# EAGLE schematic teensy_speeduino_5.1 (EAGLE 9.5.0)
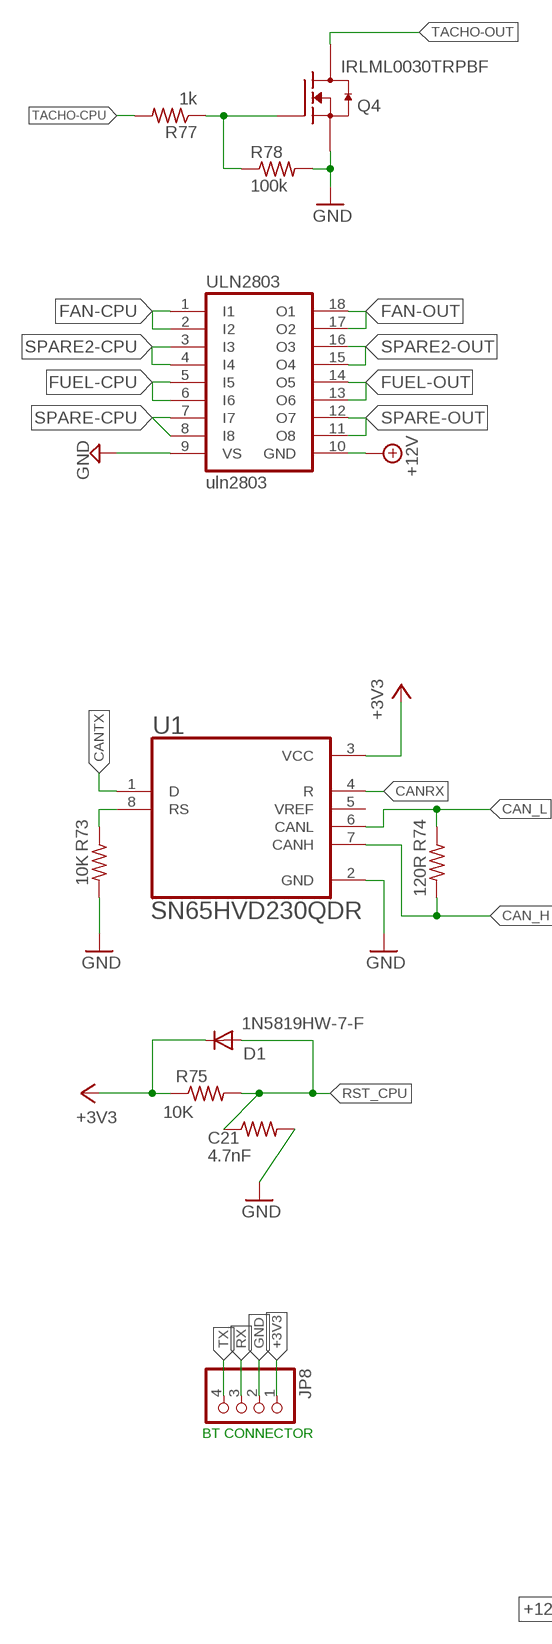
[diagram p0: schematic, sheet 1, part 1 of 2]
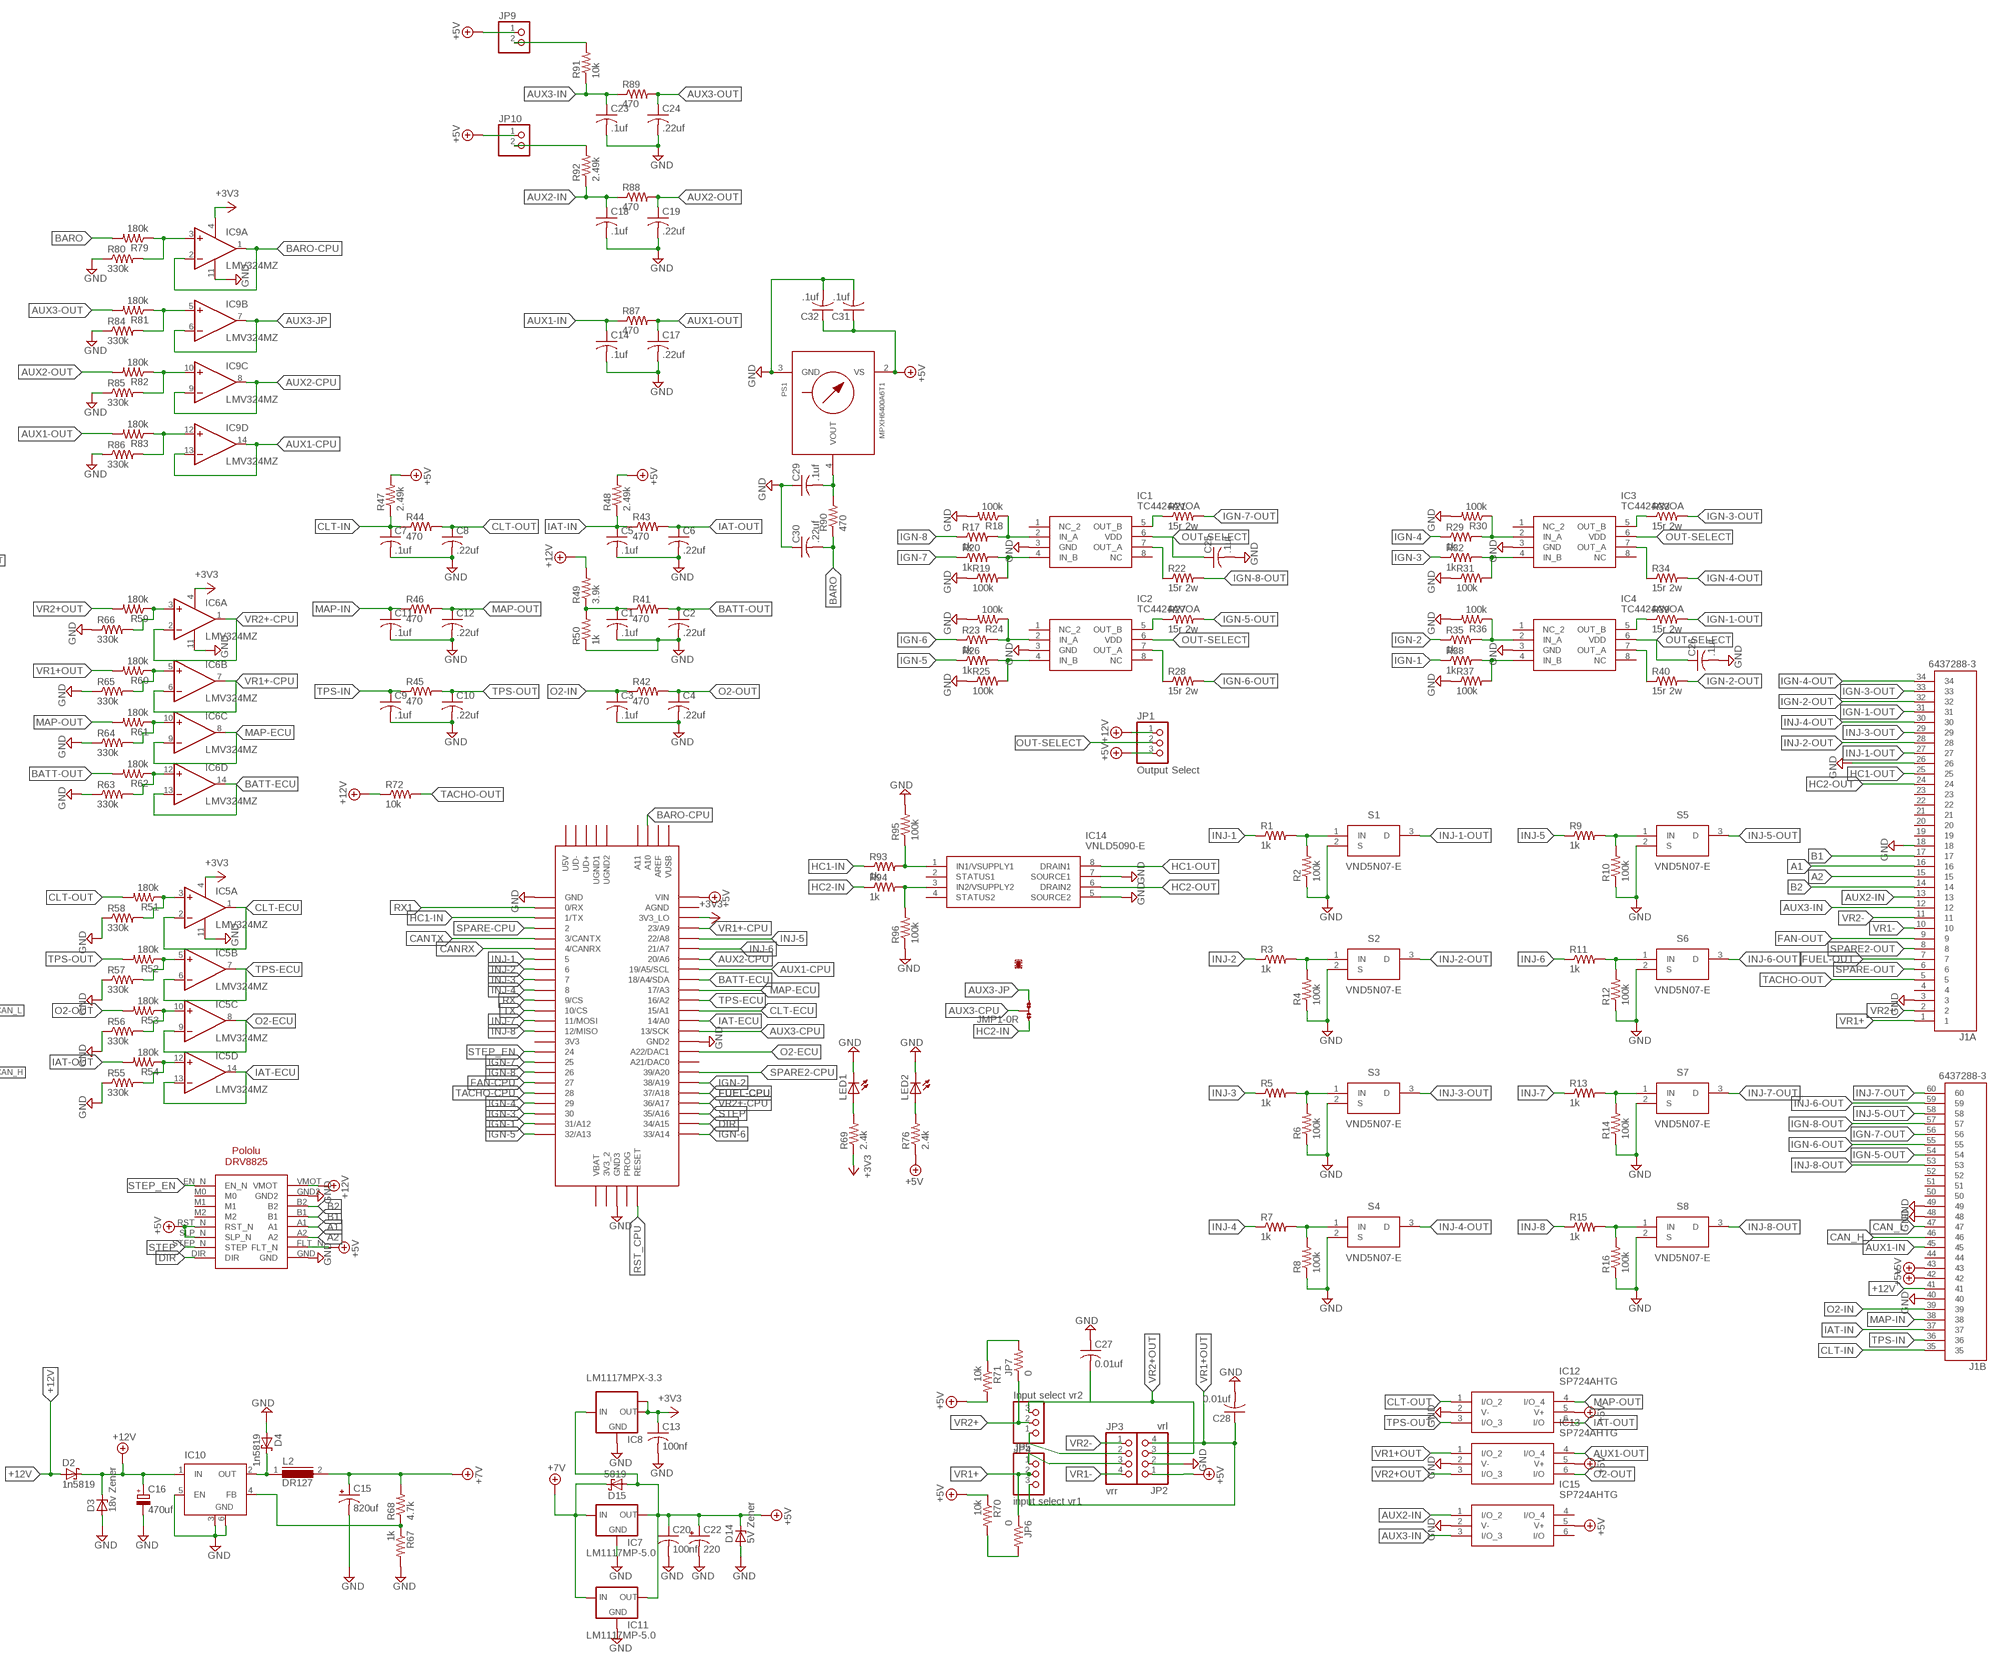
[diagram p1: schematic, sheet 1, part 2 of 2]

## Parts
C1  .1uf  C-USC1206  [C1206]
C2  .22uf  C-USC1206  [C1206]
C3  .1uf  C-USC1206  [C1206]
C4  .22uf  C-USC1206  [C1206]
C5  .1uf  C-USC1206  [C1206]
C6  .22uf  C-USC1206  [C1206]
C7  .1uf  C-USC1206  [C1206]
C8  .22uf  C-USC1206  [C1206]
C9  .1uf  C-USC1206  [C1206]
C10  .22uf  C-USC1206  [C1206]
C11  .1uf  C-USC1206  [C1206]
C12  .22uf  C-USC1206  [C1206]
C13  100nf  C-USC1206  [C1206]
C14  .1uf  C-USC0805  [C0805]
C15  820uf  CPOL-US153CLV-0810  [153CLV-0810]
C16  470uf  CPOL-EU153CLV-0810  [153CLV-0810]
C17  .22uf  C-USC0805  [C0805]
C18  .1uf  C-USC0805  [C0805]
C19  .22uf  C-USC0805  [C0805]
C20  100nf  C-USC1206  [C1206]
C21  4.7nF  R-US_R1206  [R1206]
C22  220  CPOL-US153CLV-0605  [153CLV-0605]
C23  .1uf  C-USC0805  [C0805]
C24  .22uf  C-USC0805  [C0805]
C25  .1uf  C-USC0805  [C0805]
C26  .1uf  C-USC0805  [C0805]
C27  0.01uf  C-USC1206  [C1206]
C28  0.01uf  C-USC1206  [C1206]
C29  .1uf  C-USC1206  [C1206]
C30  .22uf  C-USC1206  [C1206]
C31  .1uf  C-USC1206  [C1206]
C32  .1uf  C-USC1206  [C1206]
D1  1N5819HW-7-F  DIODE-SOD123  [SOD123]
D2  1n5819  SCHOTTKY-DIODESMD  [SMB]
D3  18v Zener  ZENER-DIODESMB  [SMB]
D4  1n5819  SCHOTTKY-DIODESMD  [SMB]
D14  5V Zener  ZENER-DIODESMB  [SMB]
D15  5819  SCHOTTKY-DIODESMD  [SMB]
IC1  TC4424AVOA  [SOIC127P600X175-8N]
IC2  TC4424AVOA  [SOIC127P600X175-8N]
IC3  TC4424AVOA  [SOIC127P600X175-8N]
IC4  TC4424AVOA  [SOIC127P600X175-8N]
IC5  LMV324MZ  [TSSOP14]
IC6  LMV324MZ  [TSSOP14]
IC7  LM1117MP-5.0  [SOT223]
IC8  LM1117MPX-3.3  [SOT223]
IC9  LMV324MZ  [TSSOP14]
IC10  LM2596S  [TO263-5]
IC11  LM1117MP-5.0  [SOT223]
IC12  SP724AHTG  [SOT95P280X145-6N]
IC13  SP724AHTG  [SOT95P280X145-6N]
IC14  VNLD5090-E  [SOIC127P600X175-8N]
IC15  SP724AHTG  [SOT95P280X145-6N]
J1  6437288-3  [TE_6437288-3]
JMP1  0R-JUMPA  [A0R-JMP]
JP1  Output Select  PINHD-1X3  [1X03]
JP2  vrl  PINHD-1X4  [1X04]
JP3  vrr  PINHD-1X4  [1X04]
JP4  Input select vr2  PINHD-1X3  [1X03]
JP5  input select vr1  PINHD-1X3  [1X03]
JP6  0  R-US_R0805  [R0805]
JP7  0  R-US_R0805  [R0805]
JP8  PINHD-1X4  [1X04]
JP9  PINHD-1X2  [1X02]
JP10  PINHD-1X2  [1X02]
L2  DR127  [DR127]
LED1  LEDSML1206  [SML1206]
LED2  LEDSML1206  [SML1206]
PS1  MPXH6400A6T1  [1317]
Q4  IRLML0030TRPBF  MOSFET-NCH_SOT-23  [SOT95P280X135-3N]
R1  1k  R-US_R1206  [R1206]
R2  100k  R-US_R1206  [R1206]
R3  1k  R-US_R1206  [R1206]
R4  100k  R-US_R1206  [R1206]
R5  1k  R-US_R1206  [R1206]
R6  100k  R-US_R1206  [R1206]
R7  1k  R-US_R1206  [R1206]
R8  100k  R-US_R1206  [R1206]
R9  1k  R-US_R1206  [R1206]
R10  100k  R-US_R1206  [R1206]
R11  1k  R-US_R1206  [R1206]
R12  100k  R-US_R1206  [R1206]
R13  1k  R-US_R1206  [R1206]
R14  100k  R-US_R1206  [R1206]
R15  1k  R-US_R1206  [R1206]
R16  100k  R-US_R1206  [R1206]
R17  1k  R-US_R1206  [R1206]
R18  100k  R-US_R1206  [R1206]
R19  100k  R-US_R1206  [R1206]
R20  1k  R-US_R1206  [R1206]
R21  15r 2w  R-US_R2512  [R2512]
R22  15r 2w  R-US_R2512  [R2512]
R23  1k  R-US_R1206  [R1206]
R24  100k  R-US_R1206  [R1206]
R25  100k  R-US_R1206  [R1206]
R26  1k  R-US_R1206  [R1206]
R27  15r 2w  R-US_R2512  [R2512]
R28  15r 2w  R-US_R2512  [R2512]
R29  1k  R-US_R1206  [R1206]
R30  100k  R-US_R1206  [R1206]
R31  100k  R-US_R1206  [R1206]
R32  1k  R-US_R1206  [R1206]
R33  15r 2w  R-US_R2512  [R2512]
R34  15r 2w  R-US_R2512  [R2512]
R35  1k  R-US_R1206  [R1206]
R36  100k  R-US_R1206  [R1206]
R37  100k  R-US_R1206  [R1206]
R38  1k  R-US_R1206  [R1206]
R39  15r 2w  R-US_R2512  [R2512]
R40  15r 2w  R-US_R2512  [R2512]
R41  470  R-US_R1206  [R1206]
R42  470  R-US_R1206  [R1206]
R43  470  R-US_R1206  [R1206]
R44  470  R-US_R1206  [R1206]
R45  470  R-US_R1206  [R1206]
R46  470  R-US_R1206  [R1206]
R47  2.49k  R-US_R1206  [R1206]
R48  2.49k  R-US_R1206  [R1206]
R49  3.9k  R-US_R1206  [R1206]
R50  1k  R-US_R1206  [R1206]
R51  180k  R-US_R1206  [R1206]
R52  180k  R-US_R1206  [R1206]
R53  180k  R-US_R1206  [R1206]
R54  180k  R-US_R1206  [R1206]
R55  330k  R-US_R1206  [R1206]
R56  330k  R-US_R1206  [R1206]
R57  330k  R-US_R1206  [R1206]
R58  330k  R-US_R1206  [R1206]
R59  180k  R-US_R1206  [R1206]
R60  180k  R-US_R1206  [R1206]
R61  180k  R-US_R1206  [R1206]
R62  180k  R-US_R1206  [R1206]
R63  330k  R-US_R1206  [R1206]
R64  330k  R-US_R1206  [R1206]
R65  330k  R-US_R1206  [R1206]
R66  330k  R-US_R1206  [R1206]
R67  1k  R-US_R1206  [R1206]
R68  4.7k  R-US_R1206  [R1206]
R69  2.4k  R-US_R1206  [R1206]
R70  10k  R-US_R1206  [R1206]
R71  10k  R-US_R1206  [R1206]
R72  10k  R-US_R1206  [R1206]
R73  10K  R-US_R1206  [R1206]
R74  120R  R-US_R1206  [R1206]
R75  10K  R-US_R1206  [R1206]
R76  2.4k  R-US_R1206  [R1206]
R77  1k  R-US_R1206  [R1206]
R78  100k  R-US_R1206  [R1206]
R79  180k  R-US_R0805  [R0805]
R80  330k  R-US_R0805  [R0805]
R81  180k  R-US_R0805  [R0805]
R82  180k  R-US_R0805  [R0805]
R83  180k  R-US_R0805  [R0805]
R84  330k  R-US_R0805  [R0805]
R85  330k  R-US_R0805  [R0805]
R86  330k  R-US_R0805  [R0805]
R87  470  R-US_R0805  [R0805]
R88  470  R-US_R0805  [R0805]
R89  470  R-US_R0805  [R0805]
R90  470  R-US_R1206  [R1206]
R91  10k  R-US_R1206  [R1206]
R92  2.49k  R-US_R1206  [R1206]
R93  1k  R-US_R1206  [R1206]
R94  1k  R-US_R1206  [R1206]
R95  100k  R-US_R1206  [R1206]
R96  100k  R-US_R1206  [R1206]
S1  VND5N07-E  [TO-252-(DPAK)_1]
S2  VND5N07-E  [TO-252-(DPAK)_1]
S3  VND5N07-E  [TO-252-(DPAK)_1]
S4  VND5N07-E  [TO-252-(DPAK)_1]
S5  VND5N07-E  [TO-252-(DPAK)_1]
S6  VND5N07-E  [TO-252-(DPAK)_1]
S7  VND5N07-E  [TO-252-(DPAK)_1]
S8  VND5N07-E  [TO-252-(DPAK)_1]
U1  SN65HVD230QDR  [SOIC127P600X175-8N]
U$1  TEENSY_3.5/3.6  [TEENSY_3.5/3.6]
U$3  POLOLU-DRV8825  [POLOLU-DRV8825]
ULN2803  uln2803  UDN2984LW  [SO18W]

## Nets
+3V3 [5V+]: C13.1 D1.C IC5.4(P:V+) IC6.4(P:V+) IC8.2(OUT) IC8.TAB(OUT1) IC9.4(P:V+) JP8.1 R69.1 R75.1 U1.3(VCC) U$1.3V3_LO
+5V [5V+]: C20.1 C22.+ C31.1 C32.1 D14.C D15.A IC7.2(OUT) IC7.4(OUT) IC8.3(IN) IC11.2(OUT) IC11.4(OUT) IC12.5(V+) IC13.5(V+) IC15.5(V+) J1.42 J1.43 JP1.3 JP2.1 JP9.1 JP10.1 PS1.2(VS) R47.2 R48.2 R70.1 R71.2 R76.1 U$1.VIN U$3.FLT_N U$3.RST_N U$3.SLP_N
+7V [Power]: C15.+ D15.C IC7.3(IN) IC11.3(IN) L2.2 R68.2
+12V [Power]: C16.+ D2.A D2.C D3.C IC10.1(IN) J1.41 JP1.1 R49.2 R72.1 U$3.VMOT ULN2803.10(GND)
A1 [Relay]: J1.16 U$3.A1
A2 [Relay]: J1.15 U$3.A2
AUX1-CPU: IC9.13(D:-IN) IC9.14(D:OUT) U$1.19/A5/SCL
AUX1-IN: C14.1 J1.45 R87.1
AUX1-OUT: C17.1 IC13.4(I/O_4) R83.2 R87.2
AUX2-CPU: IC9.8(C:OUT) IC9.9(C:-IN) U$1.20/A6
AUX2-IN: C18.1 IC15.1(I/O_2) J1.13 R88.1 R92.1
AUX2-OUT: C19.1 R82.2 R88.2
AUX3-CPU: JMP1.2 U$1.13/SCK
AUX3-IN: C23.1 IC15.3(I/O_3) J1.12 R89.1 R91.1
AUX3-JP: IC9.6(B:-IN) IC9.7(B:OUT) JMP1.3
AUX3-OUT: C24.1 R81.2 R89.2
B1 [Relay]: J1.17 U$3.B1
B2 [Relay]: J1.14 U$3.B2
BARO: C30.2 R79.2 R90.1
BARO-CPU: IC9.1(A:OUT) IC9.2(A:-IN) U$1.A10
BATT-ECU: IC6.13(D:-IN) IC6.14(D:OUT) U$1.18/A4/SDA
BATT-OUT: C2.1 R41.2 R62.2
CAN_H: J1.46 R74.2 U1.7(CANH)
CAN_L: J1.47 R74.1 U1.6(CANL)
CANRX: U1.4(R) U$1.4/CANRX
CANTX: U1.1(D) U$1.3/CANTX
CLT-ECU: IC5.1(A:OUT) IC5.2(A:-IN) U$1.15/A1
CLT-IN: C7.1 J1.35 R44.1 R47.1
CLT-OUT: C8.1 IC12.1(I/O_2) R44.2 R51.2
DIR: U$1.34/A15 U$3.DIR
FAN-CPU: U$1.27 ULN2803.1(I1) ULN2803.2(I2)
FAN-OUT [Relay]: J1.9 ULN2803.17(O2) ULN2803.18(O1)
FUEL-CPU: U$1.37/A18 ULN2803.5(I5) ULN2803.6(I6)
FUEL-OUT [Relay]: J1.7 ULN2803.13(O6) ULN2803.14(O5)
GND [GND]: C1.2 C2.2 C3.2 C4.2 C5.2 C6.2 C7.2 C8.2 C9.2 C10.2 C11.2 C12.2 C13.2 C14.2 C15.- C16.- C17.2 C18.2 C19.2 C20.2 C21.2 C22.- C23.2 C24.2 C25.2 C26.2 C27.1 C28.2 C29.1 C30.1 C31.2 C32.2 D3.A D4.A D14.A IC1.3(GND) IC2.3(GND) IC3.3(GND) IC4.3(GND) IC5.11(P:V-) IC6.11(P:V-) IC7.1(GND) IC8.1(GND) IC9.11(P:V-) IC10.3(GND) IC10.5(EN) IC10.6(GND) IC11.1(GND) IC12.2(V-) IC13.2(V-) IC14.5(SOURCE2) IC14.7(SOURCE1) IC15.2(V-) J1.3 J1.18 J1.26 J1.40 J1.48 J1.49 JP2.2 JP8.2 LED1.C LED2.C PS1.3(GND) Q4.2(S) R2.1 R4.1 R6.1 R8.1 R10.1 R12.1 R14.1 R16.1 R18.2 R19.1 R24.2 R25.1 R30.2 R31.1 R36.2 R37.1 R50.1 R55.1 R56.1 R57.1 R58.1 R63.1 R64.1 R65.1 R66.1 R67.2 R73.2 R78.2 R80.1 R84.1 R85.1 R86.1 R95.2 R96.1 S1.2(S) S2.2(S) S3.2(S) S4.2(S) S5.2(S) S6.2(S) S7.2(S) S8.2(S) U1.2(GND) U$1.GND U$1.GND2 U$1.GND3 U$3.GND U$3.GND2 ULN2803.9(VS)
HC1-IN: R93.1 U$1.1/TX
HC1-OUT: IC14.8(DRAIN1) J1.25
HC2-IN: JMP1.1 R94.1
HC2-OUT: IC14.6(DRAIN2) J1.24
IAT-ECU: IC5.13(D:-IN) IC5.14(D:OUT) U$1.14/A0
IAT-IN: C5.1 J1.37 R43.1 R48.1
IAT-OUT: C6.1 IC12.6(I/O) R43.2 R54.2
IGN-1: R38.1 U$1.31/A12
IGN-1-OUT [IGN]: J1.31 R39.2
IGN-2: R35.1 U$1.38/A19
IGN-2-OUT [IGN]: J1.32 R40.2
IGN-3: R32.1 U$1.30
IGN-3-OUT [IGN]: J1.33 R33.2
IGN-4: R29.1 U$1.29
IGN-4-OUT [IGN]: J1.34 R34.2
IGN-5: R26.1 U$1.32/A13
IGN-5-OUT [IGN]: J1.54 R27.2
IGN-6: R23.1 U$1.33/A14
IGN-6-OUT [IGN]: J1.55 R28.2
IGN-7: R20.1 U$1.25
IGN-7-OUT [IGN]: J1.56 R21.2
IGN-8: R17.1 U$1.26
IGN-8-OUT [IGN]: J1.57 R22.2
INJ-1: R1.1 U$1.5
INJ-1-OUT [Output]: J1.27 S1.3(D)
INJ-2: R3.1 U$1.6
INJ-2-OUT [Output]: J1.28 S2.3(D)
INJ-3: R5.1 U$1.7
INJ-3-OUT [Output]: J1.29 S3.3(D)
INJ-4: R7.1 U$1.8
INJ-4-OUT [Output]: J1.30 S4.3(D)
INJ-5: R9.1 U$1.22/A8
INJ-5-OUT [Output]: J1.58 S5.3(D)
INJ-6: R11.1 U$1.21/A7
INJ-6-OUT [Output]: J1.59 S6.3(D)
INJ-7: R13.1 U$1.11/MOSI
INJ-7-OUT [Output]: J1.60 S7.3(D)
INJ-8: R15.1 U$1.12/MISO
INJ-8-OUT [Output]: J1.53 S8.3(D)
MAP-ECU: IC6.8(C:OUT) IC6.9(C:-IN) U$1.17/A3
MAP-IN: C11.1 J1.38 R46.1
MAP-OUT: C12.1 IC12.4(I/O_4) R46.2 R61.2
N$1: R1.2 R2.2 S1.1(IN)
N$2: R3.2 R4.2 S2.1(IN)
N$3: JP3.3 JP5.1
N$4: JP6.2 R70.2
N$5: LED2.A R76.2
N$6: JP7.2 R71.1
N$7: R5.2 R6.2 S3.1(IN)
N$8 [IGN]: IC1.7(OUT_A) R22.1
N$9: IC10.4(FB) R67.1 R68.1
N$10: R7.2 R8.2 S4.1(IN)
N$11: D4.C IC10.2(OUT) L2.1
N$12: R73.1 U1.8(RS)
N$13: R9.2 R10.2 S5.1(IN)
N$14: LED1.A R69.2
N$15: Q4.1(G) R77.1 R78.1
N$16: R11.2 R12.2 S6.1(IN)
N$17 [IGN]: IC2.7(OUT_A) R28.1
N$18: IC9.3(A:+IN) R79.1 R80.2
N$19: R13.2 R14.2 S7.1(IN)
N$20 [IGN]: IC3.7(OUT_A) R34.1
N$21: JP10.2 R92.2
N$22: R15.2 R16.2 S8.1(IN)
N$23 [IGN]: IC4.7(OUT_A) R40.1
N$24: C29.2 PS1.4(VOUT) R90.2
N$25: IC1.2(IN_A) R17.2 R18.1
N$26: IC1.4(IN_B) R19.2 R20.2
N$27 [IGN]: IC1.5(OUT_B) R21.1
N$28: IC14.1(IN1/VSUPPLY1) R93.2 R95.1
N$29: IC2.2(IN_A) R23.2 R24.1
N$30: IC2.4(IN_B) R25.2 R26.2
N$31 [IGN]: IC2.5(OUT_B) R27.1
N$32: JP3.2 JP4.1
N$33: IC3.2(IN_A) R29.2 R30.1
N$34: IC3.4(IN_B) R31.2 R32.2
N$35 [IGN]: IC3.5(OUT_B) R33.1
N$36: IC14.3(IN2/VSUPPLY2) R94.2 R96.2
N$37: IC4.2(IN_A) R35.2 R36.1
N$38: IC4.4(IN_B) R37.2 R38.2
N$39 [IGN]: IC4.5(OUT_B) R39.1
N$40: JP9.2 R91.2
N$41: IC6.3(A:+IN) R59.1 R66.2
N$42: C1.1 R41.1 R49.1 R50.2
N$43: IC5.3(A:+IN) R51.1 R58.2
N$44: IC5.5(B:+IN) R52.1 R57.2
N$45: IC5.10(C:+IN) R53.1 R56.2
N$46: IC5.12(D:+IN) R54.1 R55.2
N$50: IC9.5(B:+IN) R81.1 R84.2
N$51: IC6.5(B:+IN) R60.1 R65.2
N$52: IC6.10(C:+IN) R61.1 R64.2
N$53: IC6.12(D:+IN) R62.1 R63.2
N$54: IC9.10(C:+IN) R82.1 R85.2
N$55: IC9.12(D:+IN) R83.1 R86.2
O2-ECU: IC5.8(C:OUT) IC5.9(C:-IN) U$1.A22/DAC1
O2-IN: C3.1 J1.39 R42.1
O2-OUT: C4.1 IC13.6(I/O) R42.2 R53.2
OUT-SELECT [IGN]: C25.1 C26.1 IC1.6(VDD) IC2.6(VDD) IC3.6(VDD) IC4.6(VDD) JP1.2
RST_CPU: C21.1 D1.A R75.2 U$1.RESET
RX: JP8.3 U$1.9/CS
RX1: U$1.0/RX
SPARE2-CPU: U$1.39/A20 ULN2803.3(I3) ULN2803.4(I4)
SPARE2-OUT: J1.8 ULN2803.15(O4) ULN2803.16(O3)
SPARE-CPU: U$1.2 ULN2803.7(I7) ULN2803.8(I8)
SPARE-OUT [Relay]: J1.6 ULN2803.11(O8) ULN2803.12(O7)
STEP: U$1.35/A16 U$3.STEP_N(STEP)
STEP_EN: U$1.24 U$3.EN_N
TACHO-CPU: R77.2 U$1.28
TACHO-OUT [Relay]: J1.5 Q4.3(D) R72.2
TPS-ECU: IC5.6(B:-IN) IC5.7(B:OUT) U$1.16/A2
TPS-IN: C9.1 J1.36 R45.1
TPS-OUT: C10.1 IC12.3(I/O_3) R45.2 R52.2
TX: JP8.4 U$1.10/CS
VR1+: J1.1 JP5.2 JP6.1
VR1+-CPU: IC6.6(B:-IN) IC6.7(B:OUT) U$1.23/A9
VR1+OUT: C28.1 IC13.1(I/O_2) JP2.4 JP5.3 R60.2
VR1-: J1.10 JP3.4
VR2+: J1.2 JP4.2 JP7.1
VR2+-CPU: IC6.1(A:OUT) IC6.2(A:-IN) U$1.36/A17
VR2+OUT: C27.2 IC13.3(I/O_3) JP2.3 JP4.3 R59.2
VR2-: J1.11 JP3.1
Unconnected: IC1.1(NC_2) IC1.8(NC) IC2.1(NC_2) IC2.8(NC) IC3.1(NC_2) IC3.8(NC) IC4.1(NC_2) IC4.8(NC) IC14.2(STATUS1) IC14.4(STATUS2) IC15.4(I/O_4) IC15.6(I/O) J1.4 J1.19 J1.20 J1.21 J1.22 J1.23 J1.44 J1.50 J1.51 J1.52 PS1.1(NC) PS1.5(NC) PS1.6(NC) U1.5(VREF) U$1.3V3 U$1.3V3_2 U$1.21/DAC0(A21/DAC0) U$1.A11 U$1.AGND U$1.AREF U$1.PROG U$1.U5V U$1.UD+ U$1.UD- U$1.UGND1 U$1.UGND2 U$1.VBAT U$1.VUSB U$3.M0 U$3.M1 U$3.M2

## Notes on the sheet
- BT CONNECTOR

## Library data of the parts
C1-C14 C17-C20 C23-C32 = resistor:C-US: CAPACITOR, American symbol
C15 C22 = resistor:CPOL-US: POLARIZED CAPACITOR, American symbol
C16 = resistor:CPOL-EU: POLARIZED CAPACITOR, European symbol
C21 JP6 JP7 R1-R96 = resistor:R-US_: RESISTOR, American symbol
D1 = diode:DIODE-: DIODE
D2 D4 D15 = diode:SCHOTTKY-DIODE: Schottky Diode
D3 D14 = diode:ZENER-DIODE: Z-Diode
IC1-IC4 = TC4424AVOA:TC4424AVOA: 3A Dual High-Speed Power MOSFET Drivers Source: Datasheet <http://componentsearchengine.com/Datasheets/1/TC4424AVOA.pdf>; DESCRIPTION: 3A Dual High-Speed Power MOSFET Drivers; HEIGHT: mm; MANUFACTURER_NAME: Microchip; MANUFACTURER_PART_NUMBER: TC4424AVOA; SUPPLIER_NAME: RS
IC5 IC6 IC9 = linear:LMV324?*: Quad General Purpose, Low Voltage, Rail-to-Rail Output Operational Amplifiers Source: http://www.national.com/mpf/LM/LMV321.html http://www.national.com/dt/lmv_qual.pdf
IC7 IC11 = lm1117_10:LM1117?-*: 800mA Low-Dropout Linear Regulator Source: http://www.ti.com/lit/ds/symlink/lm1117-n.pdf; MF: Texas Instruments; MPN: LM1117MP-5.0; OC_FARNELL: 9778209; OC_NEWARK: 28X3417
IC8 = lm1117:LM1117MPX-*
IC10 = linear:LM2596S: STEP-DOWN VOLTAGE REGULATOR
IC12 IC13 IC15 = SP724AHTG:SP724AHTG: Littelfuse SP724AHTG Quad Uni-Directional Over-voltage Protector, 6-Pin SOT-23 Source: Datasheet; ARROW_PART_NUMBER: SP724AHTG; ARROW_PRICE/STOCK: https://www.arrow.com/en/products/sp724ahtg/littelfuse; DESCRIPTION: Littelfuse SP724AHTG Quad Uni-Directional Over-voltage Protector, 6-Pin SOT-23; HEIGHT: mm; MANUFACTURER_NAME: LITTELFUSE; MANUFACTURER_PART_NUMBER: SP724AHTG; RS_PART_NUMBER: 7931982; RS_PRICE/STOCK: http://uk.rs-online.com/web/p/products/7931982
IC14 = VNLD5090-E:VNLD5090-E: Gate Drivers OMNIFET III fully protect lo-side drvr Source: Datasheet <https://www.st.com/resource/en/datasheet/vnld5090-e.pdf>; DESCRIPTION: Gate Drivers OMNIFET III fully protect lo-side drvr; HEIGHT: 1.75mm; MANUFACTURER_NAME: STMicroelectronics; MANUFACTURER_PART_NUMBER: VNLD5090-E; MOUSER_PART_NUMBER: 511-VNLD5090-E; MOUSER_PRICE-STOCK: https://www.mouser.com/Search/Refine.aspx?Keyword=511-VNLD5090-E
J1 = 6437288-3:6437288-3: CONN RECPT 60POS R/A 3MM AU; COMMENT: 6437288-3; DESCRIPTION: Rectangular Power Connector, Super Seal Series, Through Hole, Receptacle, 60, 1.5 mm, Pin; DIGI-KEY_PART_NUMBER: A122211-ND; DIGI-KEY_PURCHASE_URL: https://www.digikey.com.au/product-detail/en/te-connectivity-amp-connectors/6437288-3/A122211-ND/2329276?utm_source=snapeda&utm_medium=aggregator&utm_campaign=symbol; EU_ROHS_COMPLIANCE: Compliant; MF: TE Connectivity; MP: 6437288-3; PACKAGE: None; TE_PURCHASE_URL: https://www.te.com/usa-en/product-6437288-3.html?te_bu=Cor&te_type=disp&te_campaign=seda_glo_cor-seda-global-disp-prtnr-fy19-seda-model-bom-cta_sma-317_1&elqCampaignId=32493
JMP1 = jump-0r-smd:0R-JUMP: SMD 0R 0805 Jumper
JP1 JP4 JP5 = pinhead:PINHD-1X3: PIN HEADER
JP2 JP3 JP8 = pinhead:PINHD-1X4: PIN HEADER
JP9 JP10 = pinhead:PINHD-1X2: PIN HEADER
L2 = inductors:DR127: High Power Density, High Efficiency, Shielded Inductors Source: coiltronics_dr_series.pdf
LED1 LED2 = led:LED: LED OSRAM: - CHIPLED LG R971, LG N971, LY N971, LG Q971, LY Q971, LO R971, LY R971 LH N974, LH R974 LS Q976, LO Q976, LY Q976 LO Q996 - Hyper CHIPLED LW Q18S LB Q993, LB Q99A, LB R99A - SideLED LS A670, LO A670, LY A670, LG A670, LP A670 LB A673, LV A673, LT A673, LW A673 LH A674 LY A675 LS A676, LA A676, LO A676, LY A676, LW A676 LS A679, LY A679, LG A679 - Hyper Micro SIDELED® LS Y876, LA Y876, LO Y876, LY Y876 LT Y87S - SmartLED LW L88C, LW L88S LB L89C, LB L89S, LG L890 LS L89K, LO L89K, LY L89K LS L896, LA L896, LO L896, LY L896 - TOPLED LS T670, LO T670, LY T670, LG T670, LP T670 LSG T670, LSP T670, LSY T670, LOP T670, LYG T670 LG T671, LOG T671, LSG T671 LB T673, LV T673, LT T673, LW T673 LH T674 LS T676, LA T676, LO T676, LY T676, LB T676, LH T676, LSB T676, LW T676 LB T67C, LV T67C, LT T67C, LS T67K, LO T67K, LY T67K, LW E67C LS E67B, LA E67B, LO E67B, LY E67B, LB E67C, LV E67C, LT E67C LW T67C LS T679, LY T679, LG T679 LS T770, LO T770, LY T770, LG T770, LP T770 LB T773, LV T773, LT T773, LW T773 LH T774 LS E675, LA E675, LY E675, LS T675 LS T776, LA T776, LO T776, LY T776, LB T776 LHGB T686 LT T68C, LB T68C - Hyper Mini TOPLED® LB M676 - Mini TOPLED Santana® LG M470 LS M47K, LO M47K, LY M47K Source: http://www.osram.convergy.de LUXEON: - LUMILED® LXK2-PW12-R00, LXK2-PW12-S00, LXK2-PW14-U00, LXK2-PW14-V00 LXK2-PM12-R00, LXK2-PM12-S00, LXK2-PM14-U00 LXK2-PE12-Q00, LXK2-PE12-R00, LXK2-PE12-S00, LXK2-PE14-T00, LXK2-PE14-U00 LXK2-PB12-K00, LXK2-PB12-L00, LXK2-PB12-M00, LXK2-PB14-N00, LXK2-PB14-P00, LXK2-PB14-Q00 LXK2-PR12-L00, LXK2-PR12-M00, LXK2-PR14-Q00, LXK2-PR14-R00 LXK2-PD12-Q00, LXK2-PD12-R00, LXK2-PD12-S00 LXK2-PH12-R00, LXK2-PH12-S00 LXK2-PL12-P00, LXK2-PL12-Q00, LXK2-PL12-R00 Source: www.luxeon.com KINGBRIGHT: KA-3528ASYC Source: www.kingbright.com
PS1 = mpx-freescale:MPXH6400A: High Temperature Accuracy Integrated Silicon Pressure Sensor for Measuring Absolute Pressure, On-Chip Signal Conditioned, Temperature Compensated and Calibrated INTEGRATED PRESSURE SENSOR 20 TO 400 kPA (3.0 TO 58 psi) 0.2 TO 4.8 V OUTPUT (3.0 TO 58 psi)
Q4 = ipc-7351-transistor:MOSFET-NCH_
S1-S8 = VND5N07-E:VND5N07-E: Power Switch Low-Side OMNIFET 5A TO252 STMicroelectronics VND5N07-E Intelligent Power Switch, OMNIFET: Fully Autoprotected Power MOSFET, 5A, 70V, 3-Pin <https://componentsearchengine.com/Images/3/VND5N07-E.jpg> Source: Datasheet <http://www.st.com/web/en/resource/technical/document/datasheet/DM00091993.pdf>; ALLIED_NUMBER: 70389716; DESCRIPTION: Power Switch Low-Side OMNIFET 5A TO252 STMicroelectronics VND5N07-E Intelligent Power Switch, OMNIFET: Fully Autoprotected Power MOSFET, 5A, 70V, 3-Pin; HEIGHT: mm; MANUFACTURER_NAME: STMicroelectronics; MANUFACTURER_PART_NUMBER: VND5N07-E; RS_PART_NUMBER: 3511351; SUPPLIER_NAME: RS
U1 = SN65HVD230QDR:SN65HVD230QDR: Automotive Catalog 3.3-V CAN Transceivers 8-SOIC -40 to 125; AVAILABILITY: Good; DESCRIPTION: Automotive Catalog 3.3-V CAN Transceivers 8-SOIC -40 to 125; MF: Texas Instruments; MP: SN65HVD230QDR; PACKAGE: SOIC-8 Texas Instruments; PRICE: 1.62 USD
U$1 = Teensy356:TEENSY_3.5/3.6
U$3 = alvarop-lib:POLOLU-DRV8825
ULN2803 = uln-udn:UDN298*: DRIVER ARRAY Source: Allegro Microsystems Inc. / UDN2981-UDN2984.pdf

## Net classes
0 default: width 0.254 mm, clearance 0.152 mm
1 Power: width 0.508 mm, clearance 0.152 mm
2 Output: width 1.27 mm, clearance 0.152 mm
3 IGN: width 0.61 mm, clearance 0.152 mm
4 5V+: width 0.305 mm, clearance 0.152 mm
5 Relay: width 0.406 mm, clearance 0.152 mm
6 GND: width 0.305 mm, clearance 0.152 mm